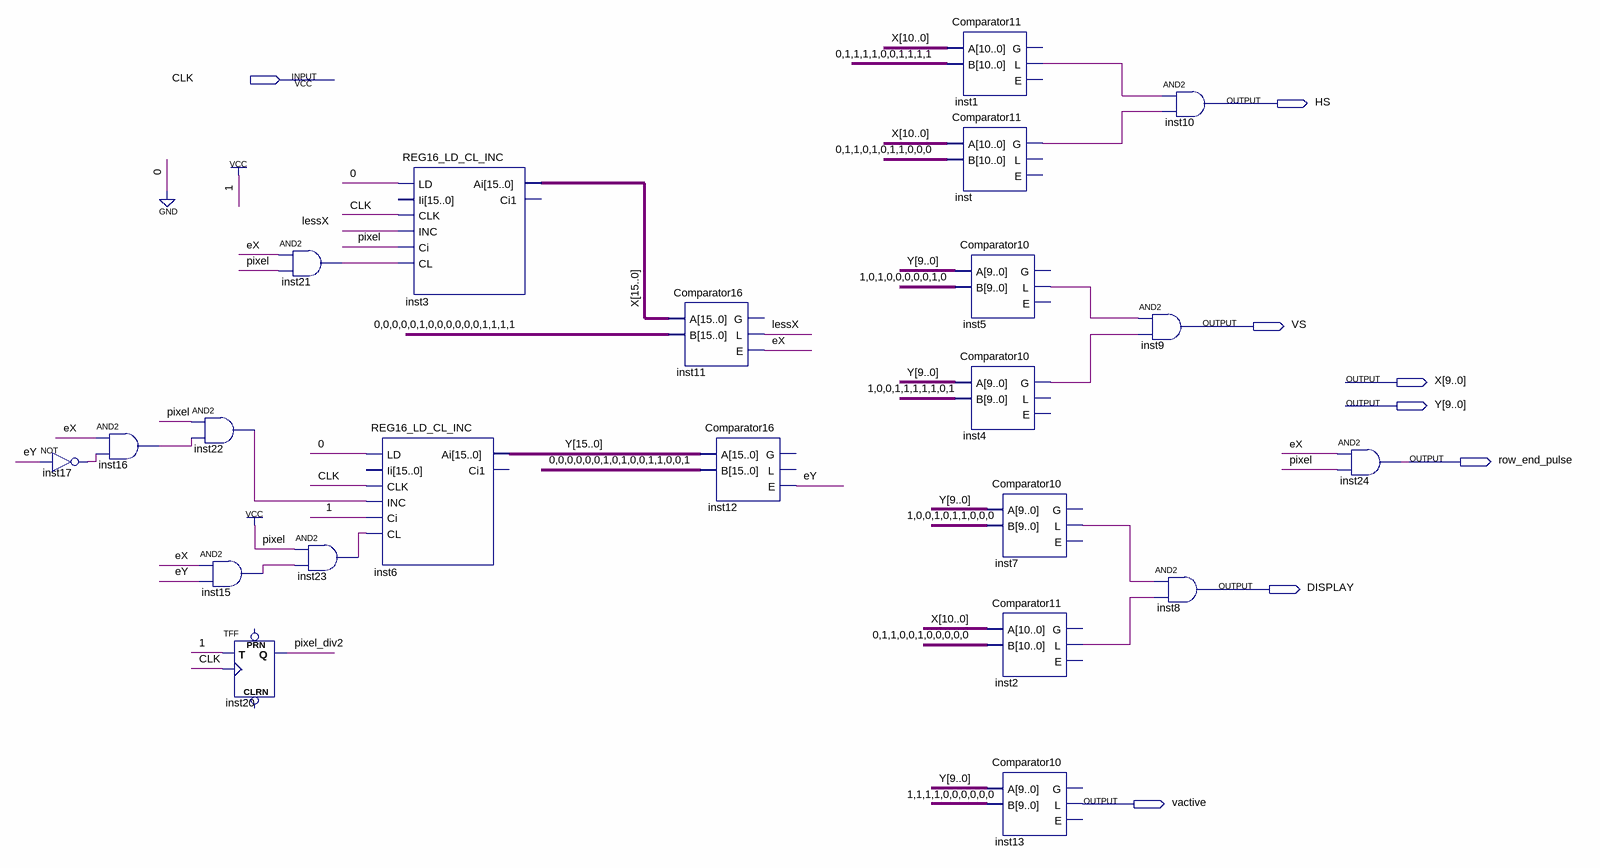
[diagram p0: schematic sheet]
// Quartus schematic Controller.bdf as structural Verilog: 22 symbols, 8 pins
module Controller (
  input  CLK,
  output HS,
  output VS,
  output [15:0] X,
  output [15:0] Y,
  output row_end_pulse,
  output DISPLAY,
  output vactive
);

  wire eX, eY, inst1_l, inst2_l, inst4_g, inst5_l, inst7_l, inst15_out, inst16_out, inst17_out, inst21_out,
       inst22_out, inst23_out, inst_g, lessX, pixel_div2;

  not inst17 (inst17_out, eY);
  and inst16 (inst16_out, eX, inst17_out);
  and inst22 (inst22_out, 1'b1, inst16_out);
  and inst15 (inst15_out, eX, eY);
  TFF inst20 (.T(1'b1), .CLK(CLK), .Q(pixel_div2));  // open: PRN, CLRN
  and inst21 (inst21_out, eX, 1'b1);
  and inst23 (inst23_out, 1'b1, inst15_out);
  REG16_LD_CL_INC inst6 (.LD(1'b0), .CLK(CLK), .INC(inst22_out), .Ci(1'b1), .CL(inst23_out), .Ai(Y));  // open: Ii, Ci1
  REG16_LD_CL_INC inst3 (.LD(1'b0), .CLK(CLK), .INC(lessX), .Ci(1'b1), .CL(inst21_out), .Ai(X));  // open: Ii, Ci1
  Comparator16 inst11 (.A(X), .B(16'b0000010000001111), .L(lessX), .E(eX));  // open: G
  Comparator16 inst12 (.A(Y), .B(16'b0000001010011001), .E(eY));  // open: G, L
  Comparator11 inst1 (.A(X[10:0]), .B(11'b01111001111), .L(inst1_l));  // open: G, E
  Comparator11 inst (.A(X[10:0]), .B(11'b01101011000), .G(inst_g));  // open: L, E
  Comparator10 inst5 (.A(Y[9:0]), .B(10'b1010000010), .L(inst5_l));  // open: G, E
  Comparator10 inst4 (.A(Y[9:0]), .B(10'b1001111101), .G(inst4_g));  // open: L, E
  Comparator10 inst7 (.A(Y[9:0]), .B(10'b1001011000), .L(inst7_l));  // open: G, E
  Comparator11 inst2 (.A(X[10:0]), .B(11'b01100100000), .L(inst2_l));  // open: G, E
  Comparator10 inst13 (.A(Y[9:0]), .B(10'b1111000000), .L(vactive));  // open: G, E
  and inst10 (HS, inst1_l, inst_g);
  and inst9 (VS, inst5_l, inst4_g);
  and inst8 (DISPLAY, inst7_l, inst2_l);
  and inst24 (row_end_pulse, eX, 1'b1);
endmodule
